# EAGLE design Motor Driver (EAGLE 6.4)
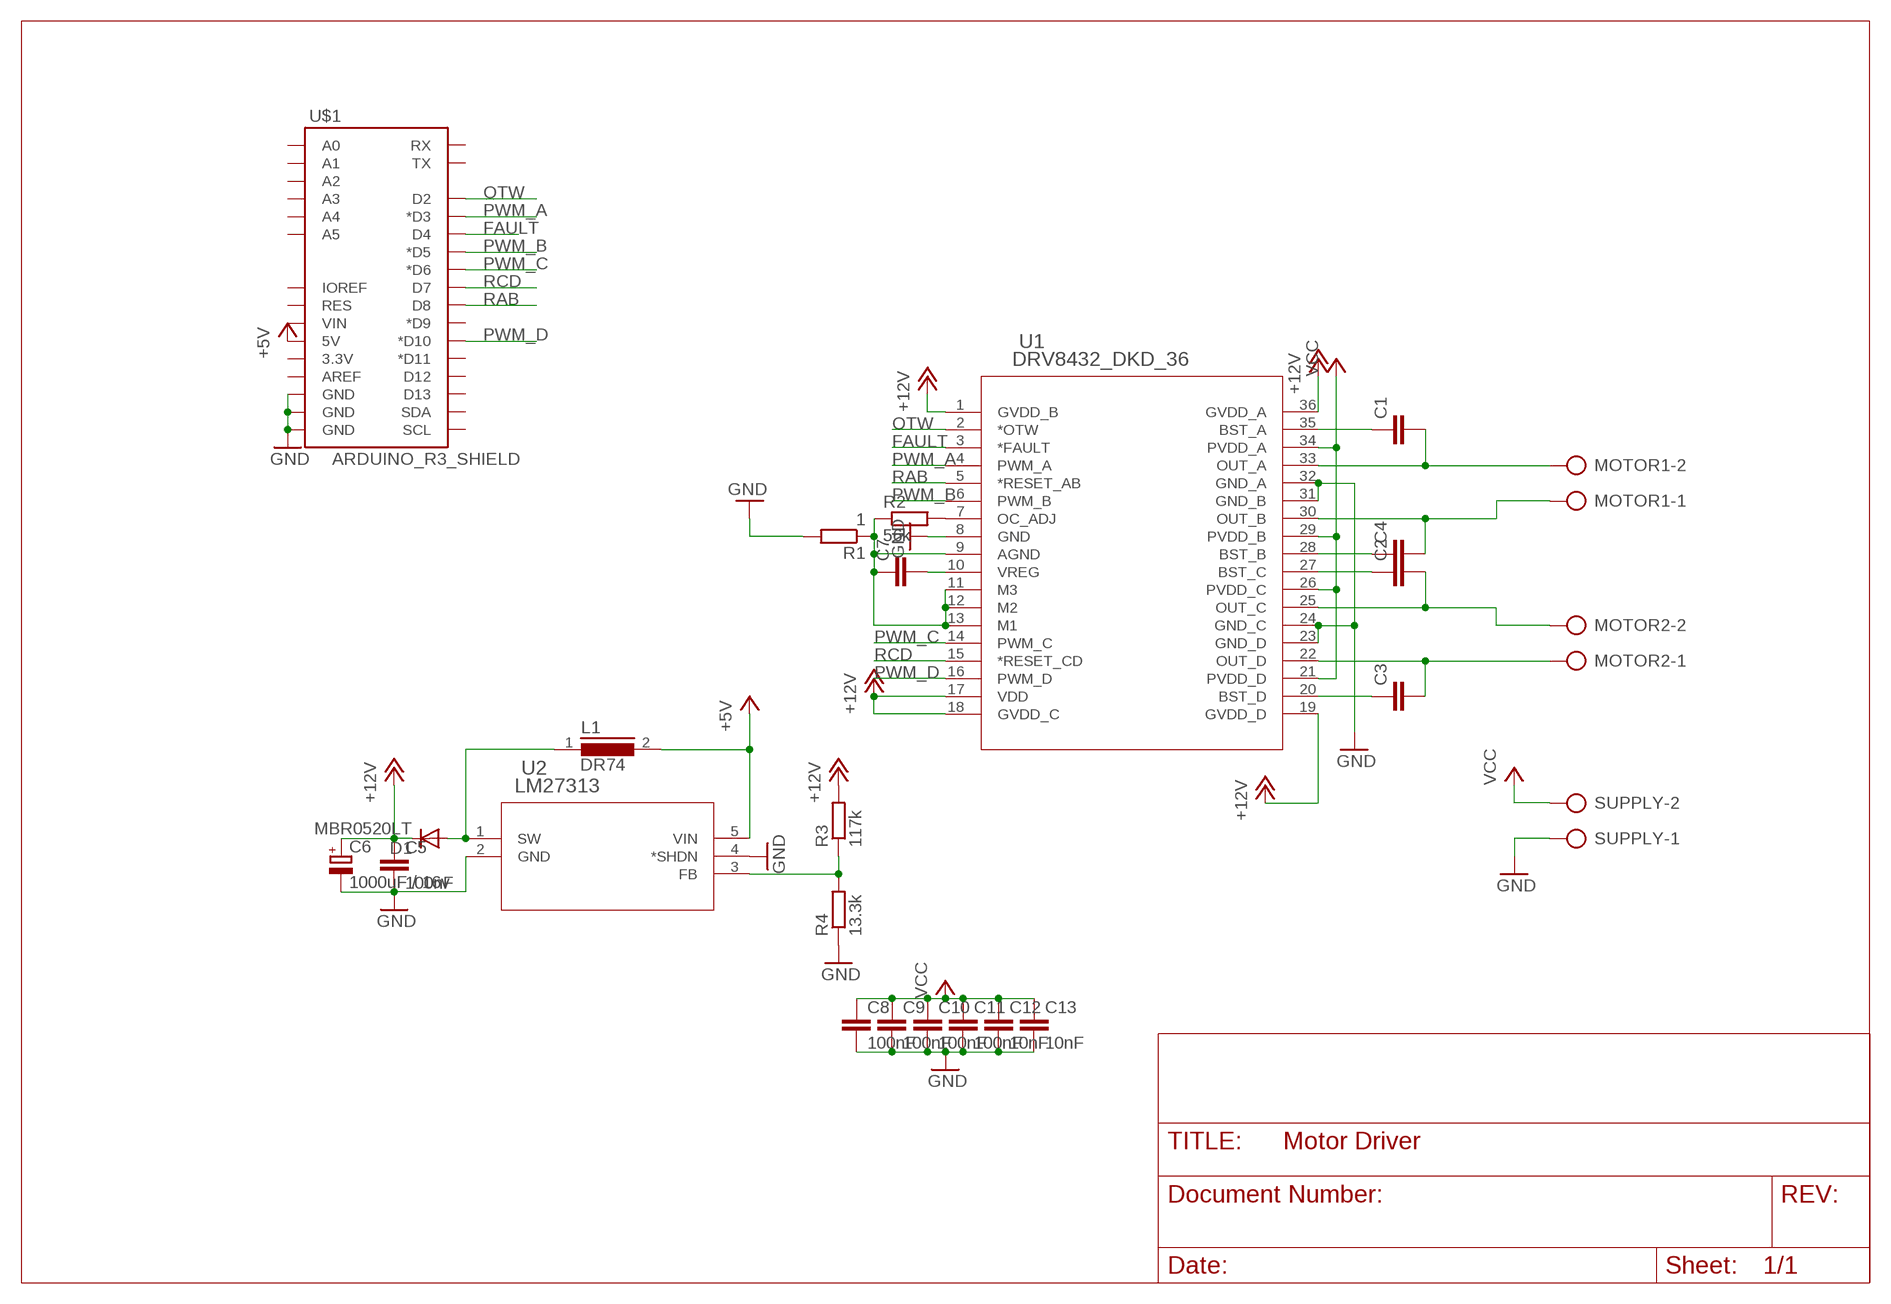
[diagram p0: schematic, sheet 1]

## Parts
C1  C-EUC0402K  [C0402K]
C2  C-EUC0402K  [C0402K]
C3  C-EUC0402K  [C0402K]
C4  C-EUC0402K  [C0402K]
C5  100nF  C-EUC0805K  [C0805K]
C6  1000uF / 16v  CPOL-EUB45181B  [B45181B]
C7  C-EUC0805K  [C0805K]
C8  100nF  C-EUC0805K  [C0805K]
C9  100nF  C-EUC0805K  [C0805K]
C10  100nF  C-EUC0805K  [C0805K]
C11  100nF  C-EUC0805K  [C0805K]
C12  10nF  C-EUC0805K  [C0805K]
C13  10nF  C-EUC0805K  [C0805K]
D1  MBR0520LT  [SOD123]
L1  DR74  [DR74]
MOTOR1  AK300/2  [AK300/2]
MOTOR2  AK300/2  [AK300/2]
R1  1  R-EU_M0805  [M0805]
R2  56k  R-EU_M0805  [M0805]
R3  117k  R-EU_R0805  [R0805]
R4  13.3k  R-EU_R0805  [R0805]
SUPPLY  AK300/2  [AK300/2]
U1  DRV8432_DKD_36  [DKD36]
U2  LM27313  [MF05A]
U$1  ARDUINO_R3_SHIELD  [UNO_R3_SHIELD]

## Nets
+5V: L1.2 U2.5(VIN) U$1.5V
+12V: C5.1 C6.+ D1.C R3.2 U1.1(GVDD_B) U1.17(VDD) U1.18(GVDD_C) U1.19(GVDD_D) U1.36(GVDD_A)
FAULT: U1.3(*FAULT) U$1.D4
GND: C5.2 C6.- C8.2 C9.2 C10.2 C11.2 C12.2 C13.2 R1.2 R4.1 SUPPLY.1 U1.8(GND) U1.23(GND_D) U1.24(GND_C) U1.31(GND_B) U1.32(GND_A) U2.2(GND) U2.4(*SHDN) U$1.GND@0(GND) U$1.GND@1(GND) U$1.GND@2(GND)
N$1: C1.1 U1.35(BST_A)
N$2: C2.1 U1.27(BST_C)
N$3: C3.1 U1.20(BST_D)
N$4: C4.1 U1.28(BST_B)
N$5: C1.2 MOTOR1.2 U1.33(OUT_A)
N$6: C4.2 MOTOR1.1 U1.30(OUT_B)
N$7: C2.2 MOTOR2.2 U1.25(OUT_C)
N$8: C3.2 MOTOR2.1 U1.22(OUT_D)
N$9: C7.2 U1.10(VREG)
N$10: D1.A L1.1 U2.1(SW)
N$11: R3.1 R4.2 U2.3(FB)
N$12: R2.2 U1.7(OC_ADJ)
N$13: C7.1 R1.1 R2.1 U1.9(AGND) U1.11(M3) U1.12(M2) U1.13(M1)
OTW: U1.2(*OTW) U$1.D2
PWM_A: U1.4(PWM_A) U$1.D3(*D3)
PWM_B: U1.6(PWM_B) U$1.D5(*D5)
PWM_C: U1.14(PWM_C) U$1.D6(*D6)
PWM_D: U1.16(PWM_D) U$1.D10(*D10)
RAB: U1.5(*RESET_AB) U$1.D8
RCD: U1.15(*RESET_CD) U$1.D7
VCC: C8.1 C9.1 C10.1 C11.1 C12.1 C13.1 SUPPLY.2 U1.21(PVDD_D) U1.26(PVDD_C) U1.29(PVDD_B) U1.34(PVDD_A)
Unconnected: U$1.3.3V U$1.A0 U$1.A1 U$1.A2 U$1.A3 U$1.A4 U$1.A5 U$1.AREF U$1.D9(*D9) U$1.D11(*D11) U$1.D12 U$1.D13 U$1.IOREF U$1.RES U$1.RX U$1.SCL U$1.SDA U$1.TX U$1.VIN

## Library data of the parts
C1-C5 C7-C13 = resistor:C-EU: CAPACITOR, European symbol
C6 = rcl:CPOL-EU: POLARIZED CAPACITOR, European symbol
D1 = diode:MBR0520LT: SCHOTTKY BARRIER RECTIFIER Source: http://onsemi.com .. MBR0520LT1-D.pdf
L1 = inductors:DR74: High Power Density, High Efficiency, Shielded Inductors Source: coiltronics_dr_series.pdf
MOTOR1 MOTOR2 SUPPLY = con-ptr500:AK300/2: CONNECTOR; OC_FARNELL: unknown; OC_NEWARK: unknown
R1-R4 = resistor:R-EU_: RESISTOR, European symbol
U1 = DRV8432:DRV8432_DKD_36; DATASHEETURL: http://www.ti.com/lit/gpn/DRV8432; DESCRIPTION: 12A Dual Brushed DC or Single Bipolar Stepper Motor Driver (PWM Ctrl); FAMILY_NAME: STEPPER DRIVER; GENERIC_PART_NUMBER: DRV8432; INDUSTRY_STD_PKG_TYPE: HSSOP; MANUFACTURER: Texas Instruments; MANUFACTURER_PART_NUMBER: drv8432_dkd_36; PACKAGE_DESIGNATOR: DKD; PIN_COUNT: 36; VENDOR: Texas Instruments
U2 = LM27313:LM27313; BASEPN: LM27313; DATASHEETURL: http://www.ti.com/lit/ds/symlink/lm27313.pdf; DESCRIPTION: 1.6 MHz Boost Converter With 30V Internal FET Switch in SOT-23; MANUFACTURER: Texas Instruments; MANUFACTURER_PART_NUMBER: lm27313_dbv_5; NSC_PACKAGEREFERENCE: MF05A; VENDOR: Texas Instruments
U$1 = SparkFun-Boards:ARDUINO_R3_SHIELD: Shield form compatible with the Arduino Uno R3.

## Board
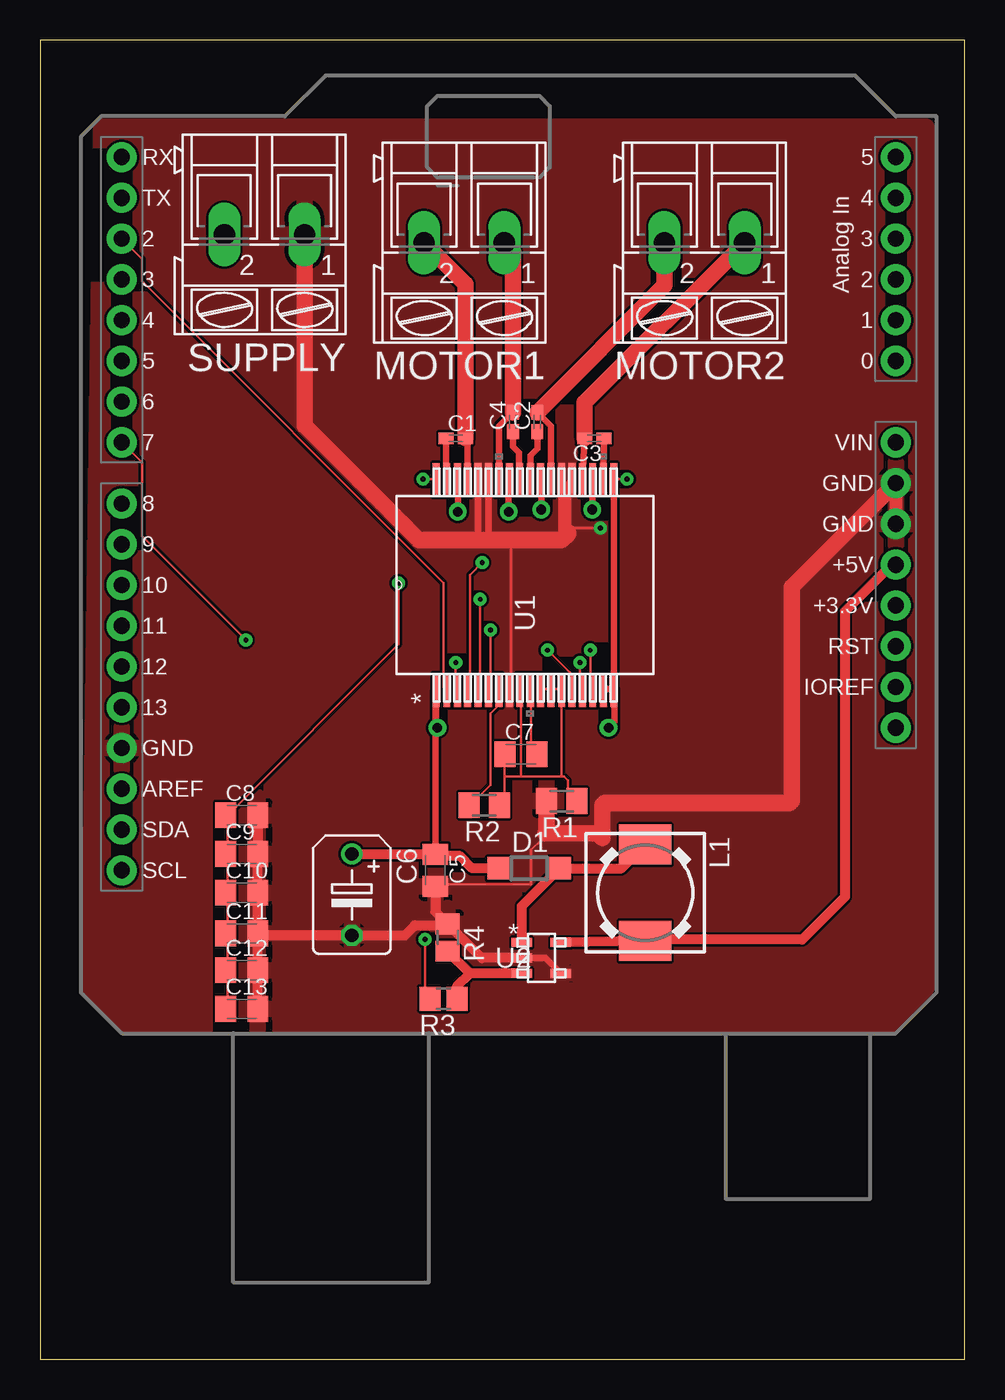
[diagram p1: board, top side]
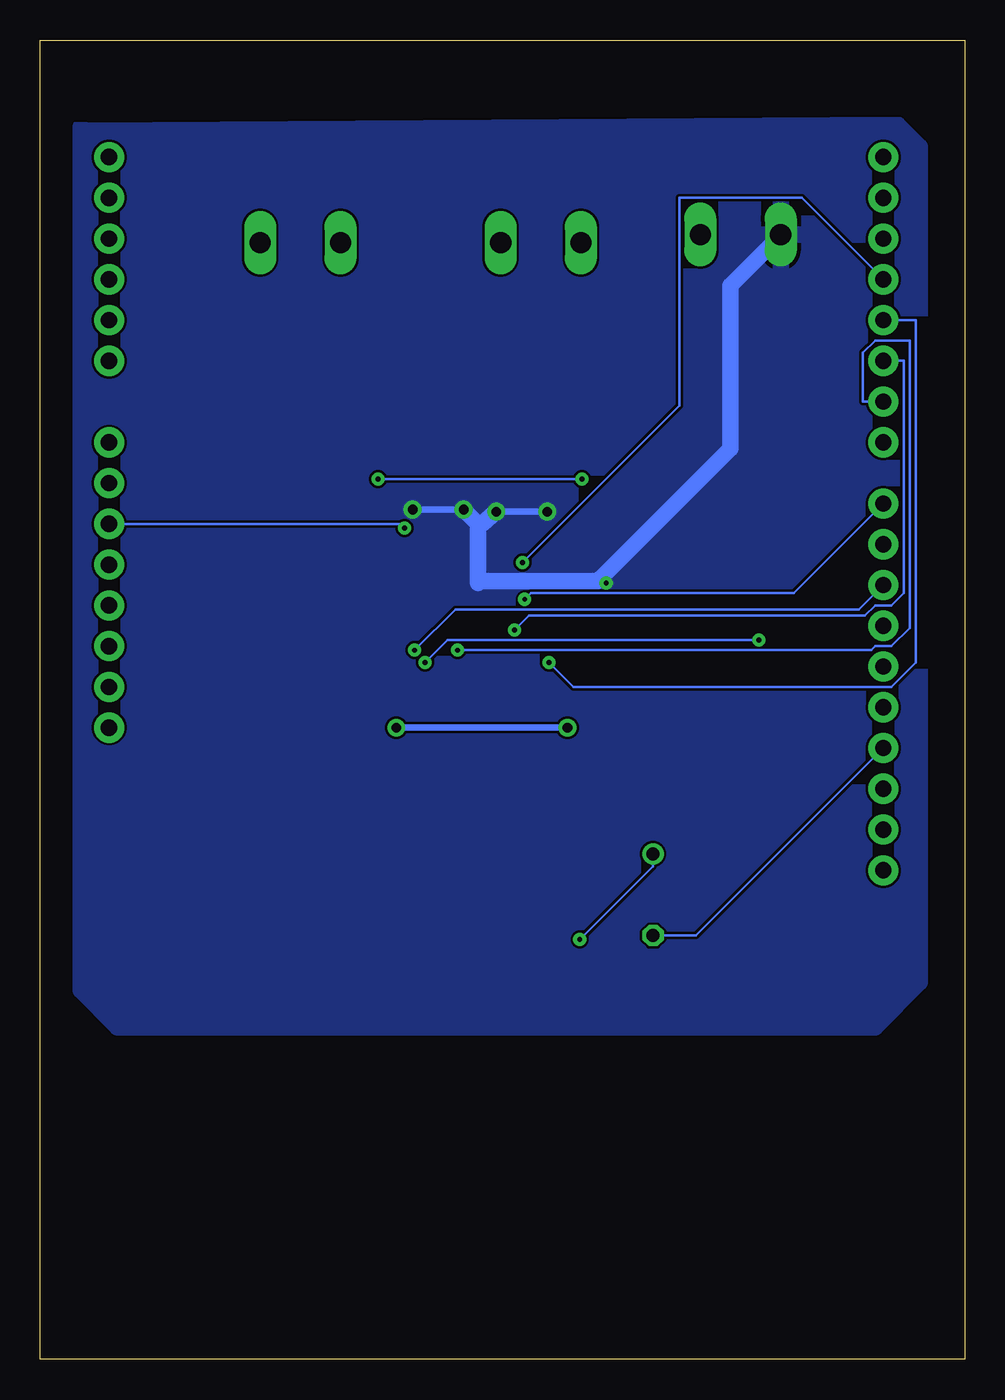
[diagram p2: board, bottom side, seen from below]

Size 57.64 x 82.22 mm. Coordinates in mm from the lower left corner, seen from the top.
Outline: 0,0 57.64,0 57.64,82.22 0,82.22 0,0
Copper layers (1*16): Top 0.035mm / dielectric 1.5mm / Bottom 0.035mm
Design rules "arduino dru": minimum track width 6mil, minimum drill 12mil, track to track 6mil, track to pad 6mil, pad to pad 6mil, via to via 6mil, smd to smd 6mil, copper to edge 40mil, drill to drill 12mil, minimum pad ring 10mil, minimum via ring 10mil, stop-mask expansion 2mil, vias tented up to drill 1mil, thermal gap 10mil

### Footprints (pad centres in the part's own frame; a part is rotated, then mirrored left to right if it is on the bottom)
C0402K = smd 0.925 x 0.74: 1 -0.6,0; 2 0.6,0
C0805K = smd 1.3 x 1.6: 1 -1,0; 2 1,0
B45181B = drill 0.813: + -2.54,0 | drill 0.813 octagon: - 2.54,0
SOD123 = smd 1.4 x 1.4: A 1.9,0; C -1.9,0
DR74 = smd 2.5 x 3.25: 1 -3,0; 2 3,0
AK300/2 = drill 1.321 long: 1 -2.515,0; 2 2.489,0
M0805 = smd 1.3 x 1.6: 1 -0.95,0; 2 0.95,0
R0805 = smd 1.3 x 1.5: 1 -0.85,0; 2 0.85,0
DKD36 = smd 2.108 x 0.432: 1 -6.553,5.537; 2 -6.553,4.877; 3 -6.553,4.216; 4 -6.553,3.581; 5 -6.553,2.921; 6 -6.553,2.286; 7 -6.553,1.626; 8 -6.553,0.965; 9 -6.553,0.33; 10 -6.553,-0.33; 11 -6.553,-0.965; 12 -6.553,-1.626; 13 -6.553,-2.286; 14 -6.553,-2.921; 15 -6.553,-3.581; 16 -6.553,-4.216; 17 -6.553,-4.877; 18 -6.553,-5.537; 19 6.553,-5.537; 20 6.553,-4.877; 21 6.553,-4.216; 22 6.553,-3.581; 23 6.553,-2.921; 24 6.553,-2.286; 25 6.553,-1.626; 26 6.553,-0.965; 27 6.553,-0.33; 28 6.553,0.33; 29 6.553,0.965; 30 6.553,1.626; 31 6.553,2.286; 32 6.553,2.921; 33 6.553,3.581; 34 6.553,4.216; 35 6.553,4.877; 36 6.553,5.537
MF05A = smd 1.27 x 0.559: 1 -1.219,0.965; 2 -1.219,0; 3 -1.219,-0.965; 4 1.219,-0.965; 5 1.219,0.965
UNO_R3_SHIELD = drill 1.016 pad 1.88: 3.3V 50.8,26.67; 5V 50.8,29.21; A0 50.8,41.91; A1 50.8,44.45; A2 50.8,46.99; A3 50.8,49.53; A4 50.8,52.07; A5 50.8,54.61; AREF 2.54,15.24; D2 2.54,49.53; D3 2.54,46.99; D4 2.54,44.45; D5 2.54,41.91; D6 2.54,39.37; D7 2.54,36.83; D8 2.54,33.02; D9 2.54,30.48; D10 2.54,27.94; D11 2.54,25.4; D12 2.54,22.86; D13 2.54,20.32; GND@0 50.8,31.75; GND@1 50.8,34.29; GND@2 2.54,17.78; IOREF 50.8,21.59; NC 50.8,19.05; RES 50.8,24.13; RX 2.54,54.61; SCL 2.54,10.16; SDA 2.54,12.7; TX 2.54,52.07; VIN 50.8,36.83

### Placement (x,y rotation side)
C1  25.91,57.4 0 top
C2  30.99,58.42 90 top
C3  34.54,57.4 180 top
C4  29.46,58.42 90 top
C5  24.64,30.48 270 top
C6  19.43,28.96 270 top
C7  29.97,37.72 0 top
C8  12.57,33.91 0 top
C9  12.57,31.5 0 top
C10  12.57,29.08 0 top
C11  12.57,26.54 0 top
C12  12.57,24.26 0 top
C13  12.57,21.84 0 top
D1  30.48,30.61 0 top
L1  37.72,29.08 270 top
MOTOR1  26.42,69.6 180 top
MOTOR2  41.4,69.6 180 top
R1  32.51,34.8 180 top
R2  27.69,34.54 180 top
R3  25.15,22.48 180 top
R4  25.4,26.29 270 top
SUPPLY  13.97,70.1 180 top
U1  30.23,48.26 90 top
U2  31.24,25.02 0 top
U$1  2.54,20.32 0 top

### Tracks (layer width: path | path; a pad name or v marks a point on that pad's centre or on a via)
+5V
  Top 0.61: U$1.5V 53.09,49.53 50.16,46.61 50.16,28.83 47.5,26.16 37.8,26.16 L1.2 U2.5
+12V  (via drill 0.3, 0.6)
  Top 0.152: v24,26.16 24,22.73 24.26,22.48 R3.2 | v23.88,54.86 24.64,54.86 U1.36 | v36.58,54.86 35.94,54.86 U1.19
  Top 0.406: 35.69,41.78 35.18,41.78 U1.17 | 35.69,41.78 U1.18 35.81,41.53 35.81,39.75 v35.43,39.37 | C5.1 24.64,39.37 | 24.64,39.37 24.64,39.5 | 24.64,39.5 24.64,41.66 U1.1 24.69,39.55 24.64,39.5 | v24.77,39.37 24.64,39.37 | 35.81,41.78 35.69,41.78 | 35.69,41.78 35.69,41.27 35.76,41.27 U1.19
  Top 0.61: D1.C 26.92,30.61 26.16,31.37 24.75,31.37 C5.1 19.45,31.48 C6.+
  Bottom 0.152: v24,26.16 19.43,30.73 C6.+ | v36.58,54.86 v23.88,54.86
  Bottom 0.406: v24.77,39.37 v35.43,39.37
FAULT  (via drill 0.3)
  Top 0.152: v25.91,43.43 25.91,41.78 U1.3
  Bottom 0.152: U$1.D4 3.05,64.77 3.05,43.43 4.57,41.91 24.38,41.91 v25.91,43.43
GND  (via drill 0.3)
  Top 0.152: 29.34,51.05 29.34,41.78 U1.8 | v34.92,51.82 33.27,51.82 32.89,51.56 | C5.2 24.89,29.59 30.61,29.59 30.61,31.75 31.24,32.38 31.5,32.77
  Top 0.406: U2.2 31.5,25.02 U2.4 | 32.89,51.56 32.89,54.56 U1.23 | 32.51,51.05 U1.24 | 29.34,51.05 27.43,51.05 27.3,50.93 | 27.3,50.93 U1.32 | 27.3,50.93 27.94,50.93 U1.31
  Top 0.61: R4.1 25.31,27.05 23.37,27.05 22.73,26.42 C6.- 13.7,26.42 C11.2 | C5.2 24.64,27.9 R4.1 | U2.2 27.52,25.02 R4.1 | C8.2 C9.2 C10.2 C11.2 | C11.2 C12.2 C13.2
  Top 0.813: U$1.GND@1 U$1.GND@0
  Top 1.016: SUPPLY.1 16.48,58.19 23.62,51.05 29.34,51.05 32.51,51.05 32.89,51.44 32.89,51.56 | U$1.GND@1 46.86,48.13 46.86,34.8 46.74,34.67 35.18,34.67 35.05,34.54 35.05,32.51 34.8,32.77 31.5,32.77 31.56,32.83 R1.2
  Bottom 0.152: U$1.GND@2 16.76,26.42 C6.- | v34.92,51.82 35.18,52.07 U$1.GND@0
  pour Top: 55.24,76.83 55.24,23.24 55.24,23.11 52.83,20.7 5.46,20.7 3.05,23.11 3.81,76.83
N$1
  Top 0.406: C1.1 25.31,54.85 U1.35
N$2
  Top 0.406: U1.27 30.56,56.34 30.99,56.77 C2.1
N$3
  Top 0.406: C3.1 U1.20
N$4
  Top 0.406: C4.1 29.46,56.9 29.84,56.52 29.84,54.86 U1.28
N$5
  Top 0.406: U1.33 26.64,57.27 C1.2
  Top 1.016: C1.2 26.51,67.02 MOTOR1.2
N$6
  Top 0.406: U1.30 28.6,58.16 C4.2
  Top 1.016: C4.2 29.46,69.06 MOTOR1.1
N$7
  Top 0.406: U1.25 31.85,58.16 C2.2
  Top 1.016: MOTOR2.2 38.91,66.94 C2.2
N$8
  Top 0.406: C3.2 U1.22
  Top 1.016: C3.2 33.94,59.62 MOTOR2.1
N$9
  Top 0.152: C7.2 30.86,37.72 30.61,37.97 30.61,41.66 U1.10
N$10
  Top 0.61: U2.1 30.02,28.25 D1.A 36.24,30.61 L1.1
N$11
  Top 0.61: U2.3 26.79,24.05 | 26.79,24.05 R4.2 | R3.1 26,23.27 26.79,24.05
N$12
  Top 0.152: R2.2 26.8,34.54 28.07,35.81 28.07,40.26 28.57,40.77 28.57,41.66 U1.7
N$13
  Top 0.152: U1.11 31.24,41.78 31.75,41.78 U1.12 31.88,41.78 32.51,41.78 U1.13 32.51,36.32 | 28.96,36.32 28.96,37.72 C7.1 | 28.96,36.32 28.96,34.8 28.7,34.54 R2.1 | 28.96,36.32 29.97,36.32 | 29.97,36.32 32.51,36.32 | 32.51,36.32 32.64,36.32 32.89,36.07 32.89,35.31 33.4,34.8 R1.1 | 29.97,36.32 29.97,41.66 U1.9
OTW
  Top 0.152: 25.27,41.66 U1.2 25.15,41.91 25.15,48.39 6.35,67.18 6.35,68.58 U$1.D2
PWM_A  (via drill 0.3)
  Top 0.152: v27.56,49.66 26.8,48.9 26.8,41.91 26.67,41.78 U1.4
  Bottom 0.152: v27.56,49.66 17.78,59.44 17.78,72.39 10.16,72.39 U$1.D3
PWM_B  (via drill 0.3)
  Top 0.152: v28.07,45.47 28.07,41.91 27.94,41.78 U1.6
  Bottom 0.152: v28.07,45.47 27.18,46.35 6.22,46.35 5.59,46.99 4.57,46.99 3.81,47.75 3.81,62.23 U$1.D5
PWM_C  (via drill 0.3)
  Top 0.152: v31.62,44.2 33.02,42.8 33.02,41.91 33.15,41.78 U1.14
  Bottom 0.152: v31.62,44.2 5.84,44.2 5.59,44.45 4.57,44.45 3.43,45.59 3.43,63.5 5.59,63.5 6.35,62.74 6.35,59.69 U$1.D6
PWM_D  (via drill 0.3)
  Top 0.152: v34.29,44.2 34.29,41.91 34.42,41.78 U1.16
  Bottom 0.152: v34.29,44.2 31.75,46.74 6.6,46.74 U$1.D10
RAB  (via drill 0.3)
  Top 0.152: v27.43,47.37 27.43,41.91 27.3,41.78 U1.5
  Bottom 0.152: v27.43,47.37 27.05,47.75 10.67,47.75 U$1.D8
RCD  (via drill 0.3)
  Top 0.152: v33.66,43.43 33.66,41.91 33.78,41.78 U1.15 | v12.83,44.83 6.35,51.31 6.35,55.88 U$1.D7
  Bottom 0.152: v33.66,43.43 32.26,44.83 v12.83,44.83
VCC  (via drill 0.3, 0.6)
  Top 0.152: 11.68,24.26 11.68,21.84 C13.1 | 11.68,24.26 11.68,26.54 | 11.68,24.26 C12.1 | 11.68,31.5 11.68,29.08 | 11.68,31.5 11.68,33.91 | 11.68,31.5 C9.1 | 11.68,29.08 11.68,26.54 | 11.68,26.54 C11.1 | 11.68,29.08 C10.1 | 11.68,33.91 22.35,44.58 v22.35,48.39 | 11.68,33.91 C8.1
  Top 0.406: v29.21,52.83 29.21,54.74 U1.29 | v26.04,52.83 26.04,54.74 U1.34 | v31.24,52.96 31.24,54.74 U1.26 | v34.42,52.96 34.42,54.74 U1.21
  Bottom 0.152: v22.35,48.39 22.67,48.7
  Bottom 0.406: v26.04,52.83 v29.21,52.83 | v34.42,52.96 v31.24,52.96
  Bottom 1.016: SUPPLY.2 11.48,70.05 14.61,66.93 14.61,56.77 22.67,48.7 22.86,48.51 30.23,48.51 30.35,48.39 30.35,52.07 | 30.35,52.07 v31.24,52.96 | 30.35,52.07 30.1,52.07 v29.21,52.83
  pour Bottom: 54.86,76.58 55.12,76.83 55.12,22.99 52.83,20.7 5.59,20.7 2.79,23.5 2.79,75.56 4.19,76.96